# EAGLE schematic Master Schematic_2.1_DRAFT (EAGLE 9.3.2)
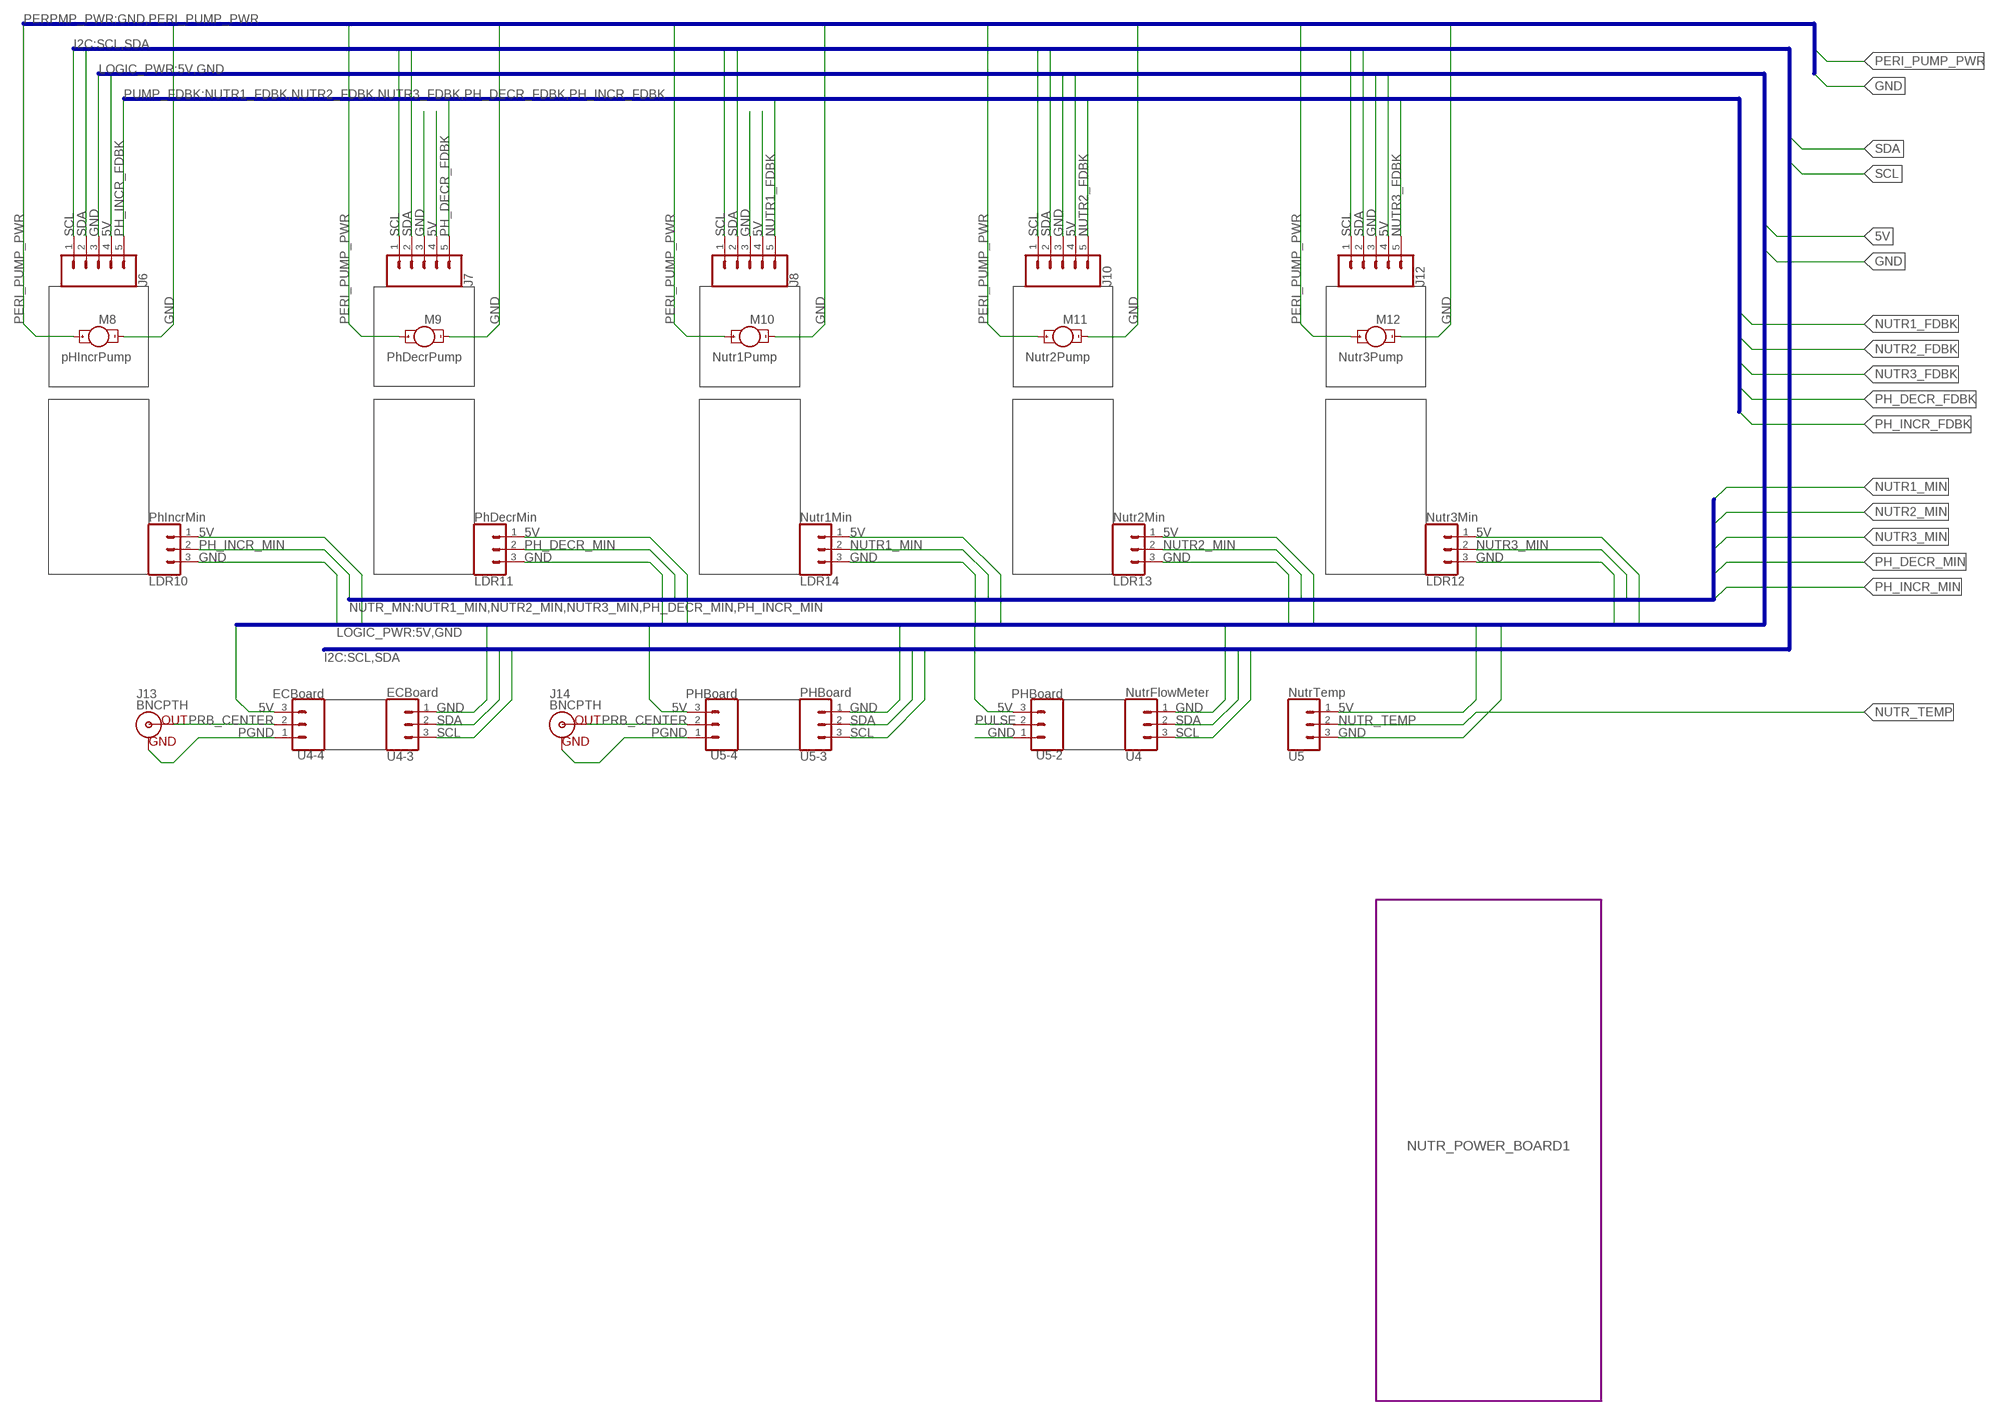
[diagram p0: schematic, sheet 1, part 1 of 2]
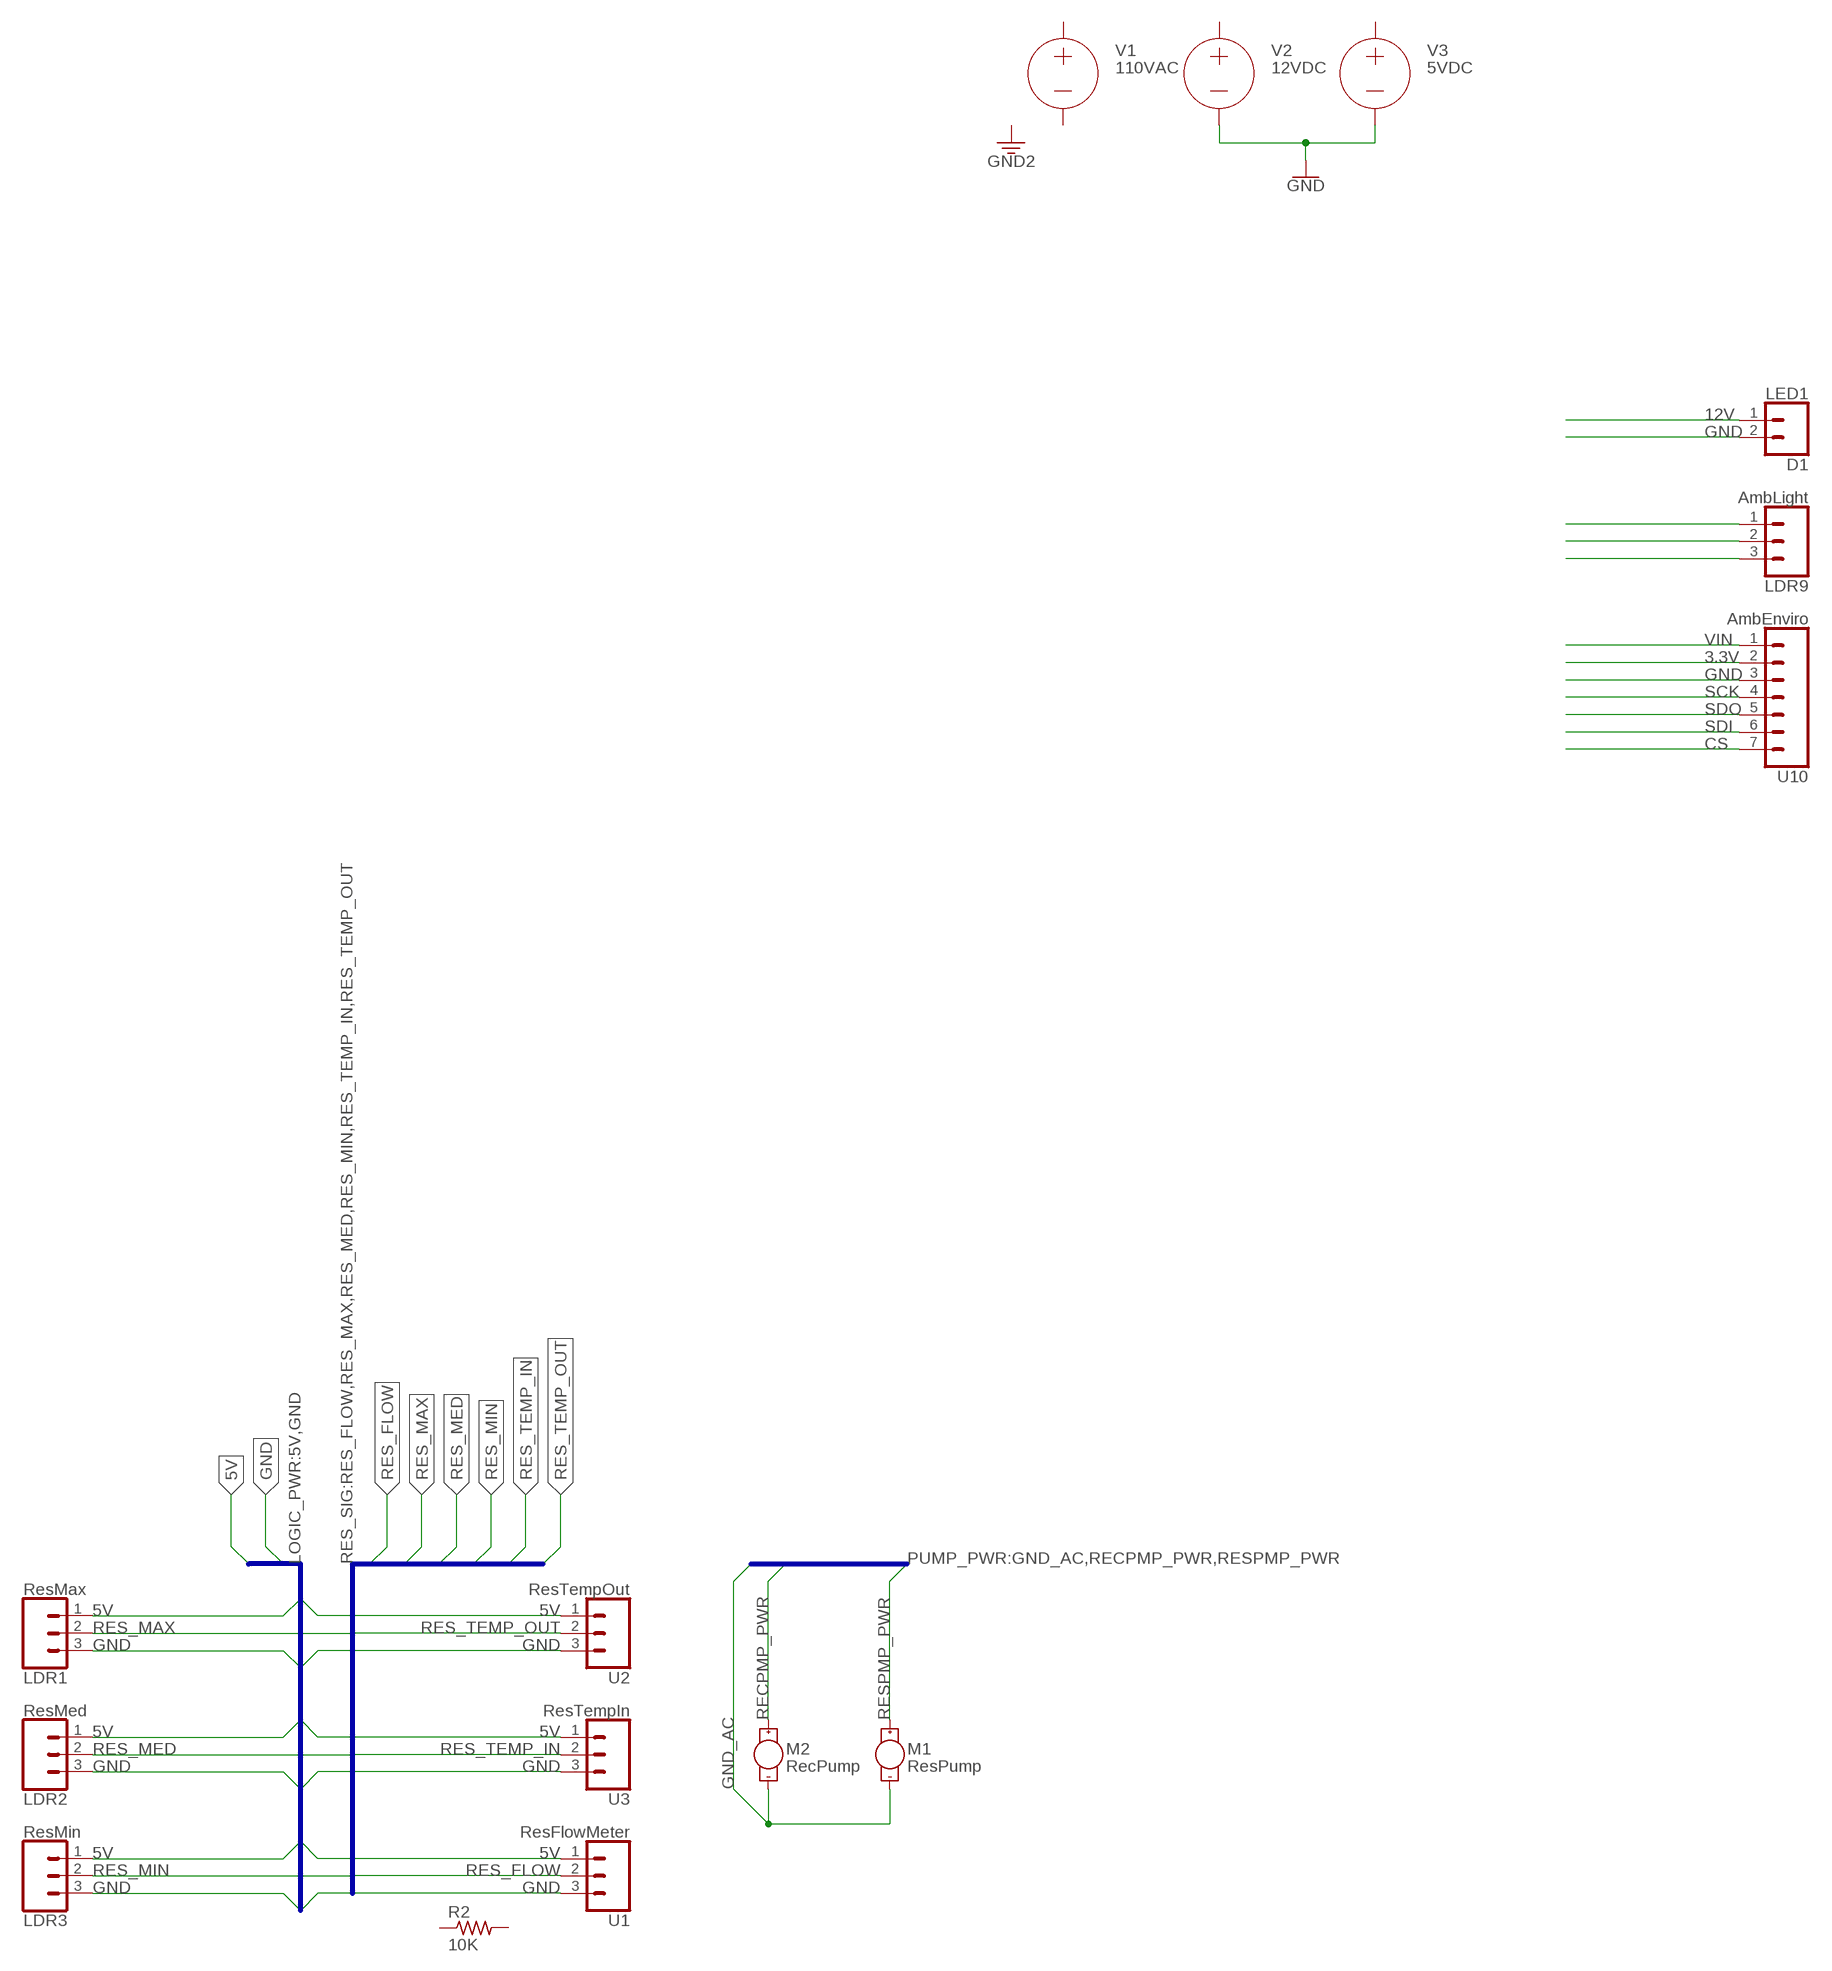
[diagram p1: schematic, sheet 1, part 2 of 2]

## Parts
D1  LED1  CONN_02  [1X02]
J6  CONN_05  [1X05]
J7  CONN_05  [1X05]
J8  CONN_05  [1X05]
J10  CONN_05  [1X05]
J12  CONN_05  [1X05]
J13  BNCPTH  [BNC]
J14  BNCPTH  [BNC]
LDR1  ResMax  CONN_03  [1X03]
LDR2  ResMed  CONN_03  [1X03]
LDR3  ResMin  CONN_03  [1X03]
LDR9  AmbLight  CONN_03  [1X03]
LDR10  PhIncrMin  CONN_03  [1X03]
LDR11  PhDecrMin  CONN_03  [1X03]
LDR12  Nutr3Min  CONN_03  [1X03]
LDR13  Nutr2Min  CONN_03  [1X03]
LDR14  Nutr1Min  CONN_03  [1X03]
M1  ResPump  MOTOR10MM  [VIBE-MOTOR-10MM]
M2  RecPump  MOTOR10MM  [VIBE-MOTOR-10MM]
M8  pHIncrPump  MOTOR10MM  [VIBE-MOTOR-10MM]
M9  PhDecrPump  MOTOR10MM  [VIBE-MOTOR-10MM]
M10  Nutr1Pump  MOTOR10MM  [VIBE-MOTOR-10MM]
M11  Nutr2Pump  MOTOR10MM  [VIBE-MOTOR-10MM]
M12  Nutr3Pump  MOTOR10MM  [VIBE-MOTOR-10MM]
R2  10K  R-US_0204/5  [0204/5]
U1  ResFlowMeter  CONN_03  [1X03]
U2  ResTempOut  CONN_03  [1X03]
U3  ResTempIn  CONN_03  [1X03]
U4  NutrFlowMeter  CONN_03  [1X03]
U4-3  ECBoard  CONN_03  [1X03]
U4-4  ECBoard  CONN_03  [1X03]
U5  NutrTemp  CONN_03  [1X03]
U5-2  PHBoard  CONN_03  [1X03]
U5-3  PHBoard  CONN_03  [1X03]
U5-4  PHBoard  CONN_03  [1X03]
U10  AmbEnviro  CONN_07  [1X07]
V1  110VAC  VOLTAGE  (no package)
V2  12VDC  VOLTAGE  (no package)
V3  5VDC  VOLTAGE  (no package)

## Module instances
NUTR_POWER_BOARD1 = NUTR_POWER_BOARD

## Nets
3.3V: U10.2
5V [DC Power]: J6.4 J7.4 J8.4 J10.4 J12.4 LDR1.1 LDR2.1 LDR3.1 LDR10.1 LDR11.1 LDR12.1 LDR13.1 LDR14.1 U1.1 U2.1 U3.1 U4-4.3 U5-2.3 U5-4.3 U5.1
12V: D1.1
CS: U10.7
GND [DC Power]: D1.2 J6.3 J7.3 J8.3 J10.3 J12.3 LDR1.3 LDR2.3 LDR3.3 LDR10.3 LDR11.3 LDR12.3 LDR13.3 LDR14.3 M8.- M9.- M10.- M11.- M12.- U1.3 U2.3 U3.3 U4-3.1 U4.1 U5-2.1 U5-3.1 U5.3 U10.3 V2.- V3.-
GND_AC: M1.- M2.-
N$7: LDR9.1
N$8: LDR9.2
N$9: LDR9.3
NUTR1_FDBK [I/O]: J8.5
NUTR1_MIN: LDR14.2
NUTR2_FDBK [I/O]: J10.5
NUTR2_MIN: LDR13.2
NUTR3_FDBK [I/O]: J12.5
NUTR3_MIN: LDR12.2
NUTR_TEMP: U5.2
PERI_PUMP_PWR: M8.+ M9.+ M10.+ M11.+ M12.+
PGND: J13.GND J14.GND U4-4.1 U5-4.1
PH_DECR_FDBK [I/O]: J7.5
PH_DECR_MIN: LDR11.2
PH_INCR_FDBK [I/O]: J6.5
PH_INCR_MIN: LDR10.2
PRB_CENTER: J13.S(OUT) J14.S(OUT) U4-4.2 U5-4.2
PULSE: U5-2.2
RECPMP_PWR: M2.+
RES_FLOW: U1.2
RES_MAX [I/O]: LDR1.2
RES_MED [I/O]: LDR2.2
RES_MIN [I/O]: LDR3.2
RES_TEMP_IN: U3.2
RES_TEMP_OUT: U2.2
RESPMP_PWR: M1.+
SCK: U10.4
SCL [I2C]: J6.1 J7.1 J8.1 J10.1 J12.1 U4-3.3 U4.3 U5-3.3
SDA [I2C]: J6.2 J7.2 J8.2 J10.2 J12.2 U4-3.2 U4.2 U5-3.2
SDI: U10.6
SDO: U10.5
VIN: U10.1
Unconnected: R2.1 R2.2 V1.+ V1.- V2.+ V3.+

## Buses
I2C:SCL,SDA
LOGIC_PWR:5V,GND
PUMP_FDBK:NUTR1_FDBK,NUTR2_FDBK,NUTR3_FDBK,PH_DECR_FDBK,PH_INCR_FDBK
PERPMP_PWR:GND,PERI_PUMP_PWR
NUTR_MN:NUTR1_MIN,NUTR2_MIN,NUTR3_MIN,PH_DECR_MIN,PH_INCR_MIN
RES_SIG:RES_FLOW,RES_MAX,RES_MED,RES_MIN,RES_TEMP_IN,RES_TEMP_OUT
PUMP_PWR:GND_AC,RECPMP_PWR,RESPMP_PWR

## Library data of the parts
D1 = SparkFun-Connectors:CONN_02: Multi connection point. Often used as Generic Header-pin footprint for 0.1 inch spaced/style header connections On any of the 0.1 inch spaced packages, you can populate with these: Break Away Headers - Straight <https://www.sparkfun.com/products/116> (PRT-00116) Break Away Male Headers - Right Angle <https://www.sparkfun.com/products/553> (PRT-00553) Female Headers <https://www.sparkfun.com/products/115> (PRT-00115) Break Away Headers - Machine Pin <https://www.sparkfun.com/products/117> (PRT-00117) Break Away Female Headers - Swiss Machine Pin <https://www.sparkfun.com/products/743> (PRT-00743) For SCREWTERMINALS and SPRING TERMINALS visit here: Screw Terimnals on SparkFun.com <https://www.sparkfun.com/search/results?term=Screw+Terminals> (5mm/3.5mm/2.54mm spacing) This device is also useful as a general connection point to wire up your design to another part of your project. Our various solder wires solder well into these plated through hole pads. Hook-Up Wire - Assortment (Stranded, 22 AWG) <https://www.sparkfun.com/products/11375> (PRT-11375) Hook-Up Wire - Assortment (Solid Core, 22 AWG) <https://www.sparkfun.com/products/11367> (PRT-11367) View the entire wire category on our website here <https://www.sparkfun.com/categories/141> Special notes: Molex polarized connector foot print use with: PRT-08233 with associated crimp pins and housings. 2.54_SCREWTERM for use with PRT-10571. 3.5mm Screw Terminal footprints for PRT-08084 5mm Screw Terminal footprints for use with PRT-08432
J6-J8 J10 J12 = SparkFun-Connectors:CONN_05: Multi connection point. Often used as Generic Header-pin footprint for 0.1 inch spaced/style header connections On any of the 0.1 inch spaced packages, you can populate with these: Break Away Headers - Straight <https://www.sparkfun.com/products/116> (PRT-00116) Break Away Male Headers - Right Angle <https://www.sparkfun.com/products/553> (PRT-00553) Female Headers <https://www.sparkfun.com/products/115> (PRT-00115) Break Away Headers - Machine Pin <https://www.sparkfun.com/products/117> (PRT-00117) Break Away Female Headers - Swiss Machine Pin <https://www.sparkfun.com/products/743> (PRT-00743) For SCREWTERMINALS and SPRING TERMINALS visit here: Screw Terimnals on SparkFun.com <https://www.sparkfun.com/search/results?term=Screw+Terminals> (5mm/3.5mm/2.54mm spacing) This device is also useful as a general connection point to wire up your design to another part of your project. Our various solder wires solder well into these plated through hole pads. Hook-Up Wire - Assortment (Stranded, 22 AWG) <https://www.sparkfun.com/products/11375> (PRT-11375) Hook-Up Wire - Assortment (Solid Core, 22 AWG) <https://www.sparkfun.com/products/11367> (PRT-11367) View the entire wire category on our website here <https://www.sparkfun.com/categories/141> Special notes: Molex polarized connector foot print use with SKU : PRT-08231 with associated crimp pins and housings. 1MM SMD Version SKU: PRT-10208
J13 J14 = SparkFun-Connectors:BNC: BNC Right Angle Connector Mouser Part# 5227161 SparkFun Products: BNC Connector - Right Angle <https://www.sparkfun.com/products/10550>; PROD_ID: LPA-12729; SF_ID: PRT-10550
LDR1-LDR3 LDR9-LDR14 U1-U4 U4-3 U4-4 U5 U5-2-U5-4 = SparkFun-Connectors:CONN_03: Multi connection point. Often used as Generic Header-pin footprint for 0.1 inch spaced/style header connections On any of the 0.1 inch spaced packages, you can populate with these: Break Away Headers - Straight <https://www.sparkfun.com/products/116> (PRT-00116) Break Away Male Headers - Right Angle <https://www.sparkfun.com/products/553> (PRT-00553) Female Headers <https://www.sparkfun.com/products/115> (PRT-00115) Break Away Headers - Machine Pin <https://www.sparkfun.com/products/117> (PRT-00117) Break Away Female Headers - Swiss Machine Pin <https://www.sparkfun.com/products/743> (PRT-00743) Stackable Header - 3 Pin (Female, 0.1") <https://www.sparkfun.com/products/13875> (PRT-13875) For SCREWTERMINALS and SPRING TERMINALS visit here: Screw Terimnals on SparkFun.com <https://www.sparkfun.com/search/results?term=Screw+Terminals> (5mm/3.5mm/2.54mm spacing) This device is also useful as a general connection point to wire up your design to another part of your project. Our various solder wires solder well into these plated through hole pads. Hook-Up Wire - Assortment (Stranded, 22 AWG) <https://www.sparkfun.com/products/11375> (PRT-11375) Hook-Up Wire - Assortment (Solid Core, 22 AWG) <https://www.sparkfun.com/products/11367> (PRT-11367) View the entire wire category on our website here <https://www.sparkfun.com/categories/141> Special notes: Molex polarized connector foot print use with SKU : PRT-08232 with associated crimp pins and housings.
M1 M2 M8-M12 = SparkFun-Electromechanical:MOTOR: Motor (Single-Phase) Two-terminal, single-phase motors. SparkFun Products Vibration Motor <https://www.sparkfun.com/products/8449> (ROB-08449) Physical dimension and wire connections for this powerful vibration motor. Motor has a self adhesive backing.; PROD_ID: COMP-08572; SF_SKU: ROB-08449
R2 = adafruit:R-US_: RESISTOR, American symbol
U10 = SparkFun-Connectors:CONN_07: Multi connection point. Often used as Generic Header-pin footprint for 0.1 inch spaced/style header connections On any of the 0.1 inch spaced packages, you can populate with these: Break Away Headers - Straight <https://www.sparkfun.com/products/116> (PRT-00116) Break Away Male Headers - Right Angle <https://www.sparkfun.com/products/553> (PRT-00553) Female Headers <https://www.sparkfun.com/products/115> (PRT-00115) Break Away Headers - Machine Pin <https://www.sparkfun.com/products/117> (PRT-00117) Break Away Female Headers - Swiss Machine Pin <https://www.sparkfun.com/products/743> (PRT-00743) For SCREWTERMINALS and SPRING TERMINALS visit here: Screw Terimnals on SparkFun.com <https://www.sparkfun.com/search/results?term=Screw+Terminals> (5mm/3.5mm/2.54mm spacing) This device is also useful as a general connection point to wire up your design to another part of your project. Our various solder wires solder well into these plated through hole pads. Hook-Up Wire - Assortment (Stranded, 22 AWG) <https://www.sparkfun.com/products/11375> (PRT-11375) Hook-Up Wire - Assortment (Solid Core, 22 AWG) <https://www.sparkfun.com/products/11367> (PRT-11367) View the entire wire category on our website here <https://www.sparkfun.com/categories/141> Special notes: Molex polarized connector foot print use with SKU : PRT-08231 with associated crimp pins and housings. 1MM SMD Version SKU: PRT-10208 NOTES ON THE VARIANTS LOCK and LOCK_LONGPADS... This footprint was designed to help hold the alignment of a through-hole component (i.e. 6-pin header) while soldering it into place. You may notice that each hole has been shifted either up or down by 0.005 of an inch from it's more standard position (which is a perfectly straight line). This slight alteration caused the pins (the squares in the middle) to touch the edges of the holes. Because they are alternating, it causes a "brace" to hold the component in place. 0.005 has proven to be the perfect amount of "off-center" position when using our standard breakaway headers. Although looks a little odd when you look at the bare footprint, once you have a header in there, the alteration is very hard to notice. Also,if you push a header all the way into place, it is covered up entirely on the bottom side.
V1-V3 = ngspice-simulation:VOLTAGE: Independent Voltage Source, either DC, AC, PULSE, SINE, PWL, EXP, or SFFM; VALUE: 0V

## Module NUTR_POWER_BOARD
Ports: 
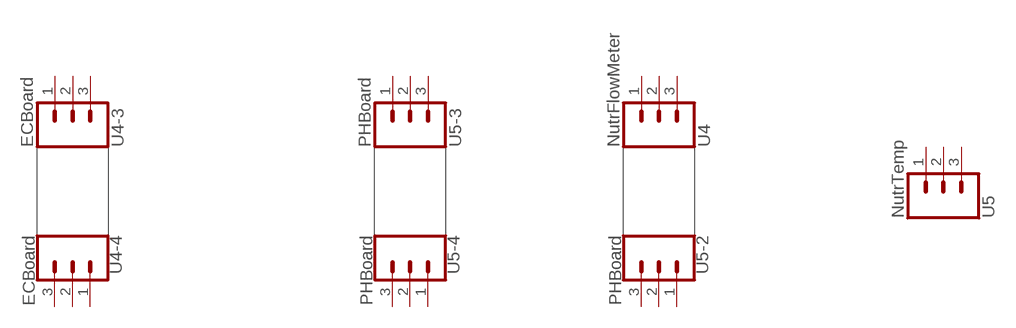
[diagram p2: schematic, module NUTR_POWER_BOARD, sheet 1]

### Parts
U4  NutrFlowMeter  CONN_03  [1X03]
U4-3  ECBoard  CONN_03  [1X03]
U4-4  ECBoard  CONN_03  [1X03]
U5  NutrTemp  CONN_03  [1X03]
U5-2  PHBoard  CONN_03  [1X03]
U5-3  PHBoard  CONN_03  [1X03]
U5-4  PHBoard  CONN_03  [1X03]
Unconnected: U4-3.1 U4-3.2 U4-3.3 U4-4.1 U4-4.2 U4-4.3 U4.1 U4.2 U4.3 U5-2.1 U5-2.2 U5-2.3 U5-3.1 U5-3.2 U5-3.3 U5-4.1 U5-4.2 U5-4.3 U5.1 U5.2 U5.3

### Library data of the parts
U4 U4-3 U4-4 U5 U5-2-U5-4 = SparkFun-Connectors:CONN_03: Multi connection point. Often used as Generic Header-pin footprint for 0.1 inch spaced/style header connections On any of the 0.1 inch spaced packages, you can populate with these: Break Away Headers - Straight <https://www.sparkfun.com/products/116> (PRT-00116) Break Away Male Headers - Right Angle <https://www.sparkfun.com/products/553> (PRT-00553) Female Headers <https://www.sparkfun.com/products/115> (PRT-00115) Break Away Headers - Machine Pin <https://www.sparkfun.com/products/117> (PRT-00117) Break Away Female Headers - Swiss Machine Pin <https://www.sparkfun.com/products/743> (PRT-00743) Stackable Header - 3 Pin (Female, 0.1") <https://www.sparkfun.com/products/13875> (PRT-13875) For SCREWTERMINALS and SPRING TERMINALS visit here: Screw Terimnals on SparkFun.com <https://www.sparkfun.com/search/results?term=Screw+Terminals> (5mm/3.5mm/2.54mm spacing) This device is also useful as a general connection point to wire up your design to another part of your project. Our various solder wires solder well into these plated through hole pads. Hook-Up Wire - Assortment (Stranded, 22 AWG) <https://www.sparkfun.com/products/11375> (PRT-11375) Hook-Up Wire - Assortment (Solid Core, 22 AWG) <https://www.sparkfun.com/products/11367> (PRT-11367) View the entire wire category on our website here <https://www.sparkfun.com/categories/141> Special notes: Molex polarized connector foot print use with SKU : PRT-08232 with associated crimp pins and housings.